# Altium schematic sheet Button.SchDoc
size 420 x 297 mm; Address1: Address1; Address2: Address2; Address3: Address3; Address4: Address4; DocumentNumber: *Э3; SheetNumber: 9; SheetTotal: 14; DocumentType: Схема электрическая *
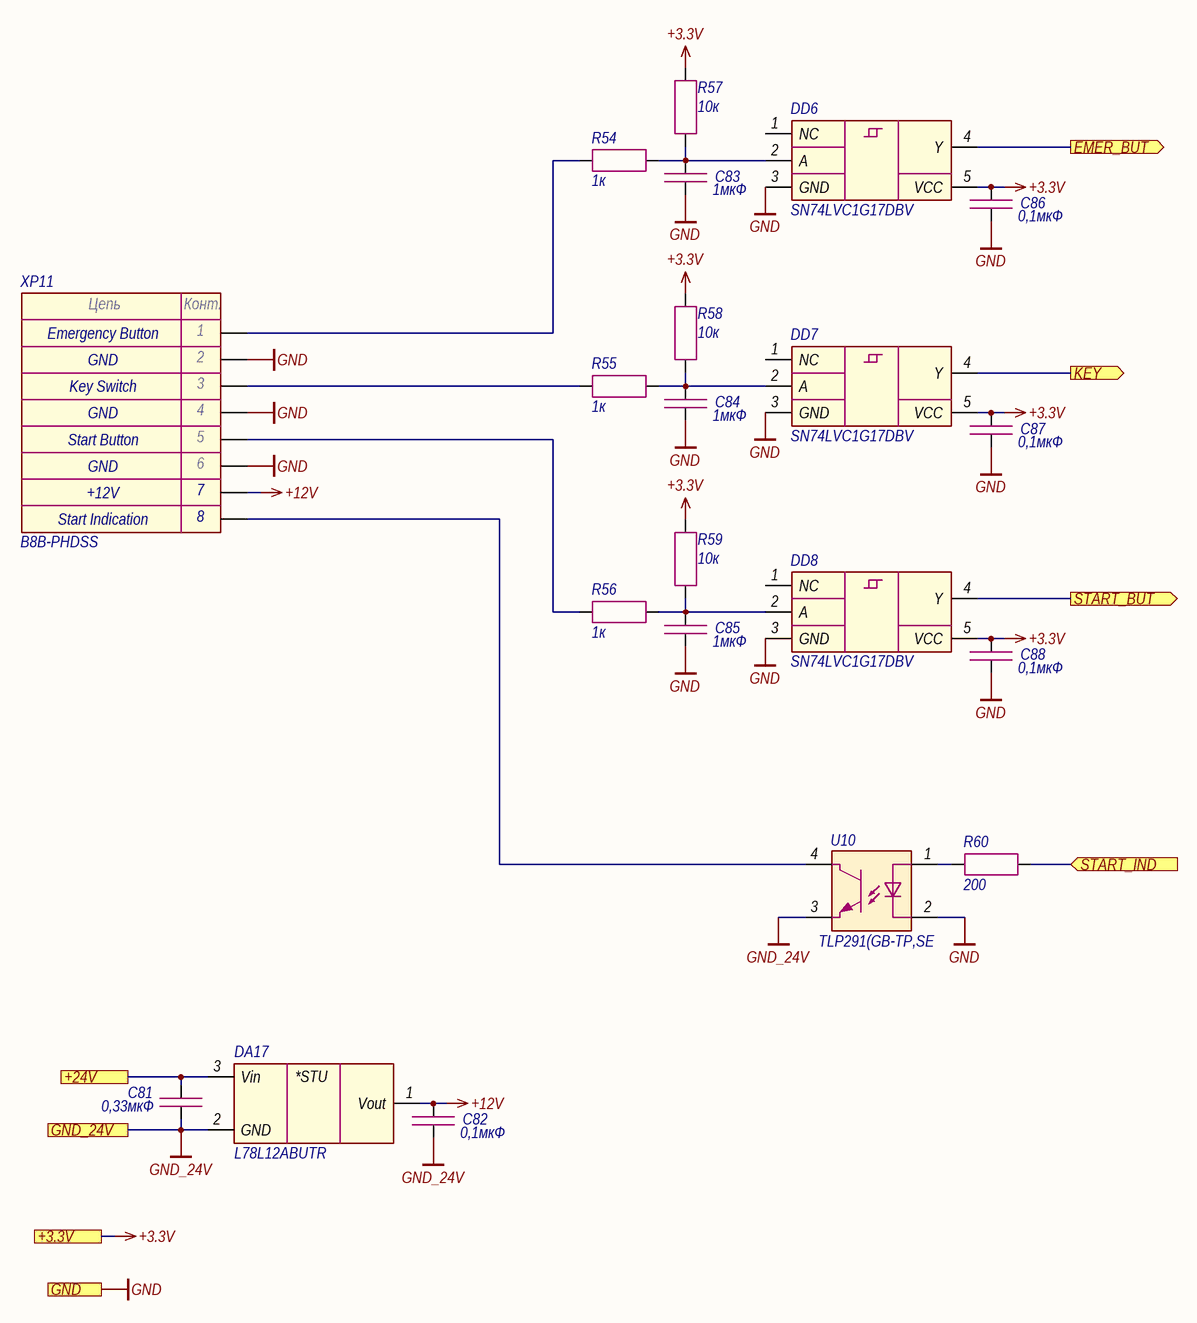
[diagram p0: Button.SchDoc]

## Parts
C81  0,33мкФ  [CAP_0805]
C82  0,1мкФ  [CAP_0603]
C83  1мкФ  [CAP_0603]
C84  1мкФ  [CAP_0603]
C85  1мкФ  [CAP_0603]
C86  0,1мкФ  [CAP_0603]
C87  0,1мкФ  [CAP_0603]
C88  0,1мкФ  [CAP_0603]
DA17  L78L12ABUTR  [SOT-89]
DD6  SN74LVC1G17DBV  [SOT-23-5]
DD7  SN74LVC1G17DBV  [SOT-23-5]
DD8  SN74LVC1G17DBV  [SOT-23-5]
R54  1к  [RES_0603]
R55  1к  [RES_0603]
R56  1к  [RES_0603]
R57  10к  [RES_0603]
R58  10к  [RES_0603]
R59  10к  [RES_0603]
R60  200  [RES_0603]
U10  TLP291(GB-TP,SE  [11-3C1]
XP11  B8B-PHDSS  [B8B-PHDSS]

## Ports
+3.3V (see Main[2C], Ethernet[3D], Fiber_interlock[2C], Flow_sensor[2C], LD_driver[1D], Power_supply[2C], RS-485[2C]), +24V (see Main[2C], Column[1C], Flow_sensor[2C], Indication[1C], LD_driver[1D]), EMER_BUT (out, see Main[2C]), GND (see Main[2C], Column[1C], Ethernet[3D], Fiber_interlock[2C], Flow_sensor[2C], Guide_laser[1C], Indication[1C], LD_driver[1D], Power_supply[2C], RS-485[2C]), GND_24V (see Main[2C], Column[1C], Flow_sensor[2C], Indication[1C], LD_driver[1D]), KEY (out, see Main[2C]), START_BUT (out, see Main[2C]), START_IND (in, see Main[2C])

## Nets
+3.3V: C86.1 C87.1 C88.1 DD6.5(VCC) DD7.5(VCC) DD8.5(VCC) R57.2 R58.2 R59.2 ; port +3.3V
+12V: C82.1 DA17.1(Vout) XP11.7
GND: C83.2 C84.2 C85.2 C86.2 C87.2 C88.2 DD6.3(GND) DD7.3(GND) DD8.3(GND) U10.2 XP11.2 XP11.4 XP11.6 ; port GND
GND_24V: C81.1 C82.2 DA17.2(GND) U10.3 ; port GND_24V
+24V: C81.2 DA17.3(Vin) ; port +24V
EMER_BUT: DD6.4(Y) ; port EMER_BUT
KEY: DD7.4(Y) ; port KEY
START_BUT: DD8.4(Y) ; port START_BUT
START_IND: R60.2 ; port START_IND
NetC83_1: C83.1 DD6.2(A) R54.2 R57.1
NetC84_1: C84.1 DD7.2(A) R55.2 R58.1
NetC85_1: C85.1 DD8.2(A) R56.2 R59.1
NetR54_1: R54.1 XP11.1
NetR55_1: R55.1 XP11.3
NetR56_1: R56.1 XP11.5
NetR60_1: R60.1 U10.1
NetU10_4: U10.4 XP11.8

Not connected (* = marked no-connect by the designer): DD6 1(NC); DD7 1(NC); DD8 1(NC)

## Notes on the sheet
- GND
- (near XP11) Emergency Button
- Start Button
- Key Switch
- +12V
- (near XP11) Start Indication
- Подп. и дата
- Инв. № дубл.
- Взам. инв. №
- Инв. № подл.
- Изм.
- Лист
- № докум.
- Подп.
- Дата
- Копировал
- Формат А3
- (in symbol Connector-8) Цепь; Конт.
- (in symbol LD2981ABU50TR) *STU

## Library data of the parts
C81 = Capacitor: Manufacturer: Murata; Model: GRM219R71H334KA88D; Value: 0,33мкФ; Document: *
C82 C86-C88 = Capacitor: Manufacturer: Murata; Model: GRM188R71H104KA93D; Value: 0,1мкФ; Document: *
C83-C85 = Capacitor: Manufacturer: Murata; Model: GRM188R61H105KAALD; Value: 1мкФ; Document: *
DA17 = LD2981ABU50TR: Manufacturer: STMicroelectronics; Model: L78L12ABUTR; Document: *
DD6-DD8 = SN74LVC1G17: Manufacturer: Texas Instruments; Model: SN74LVC1G17DBV; Document: *
R54-R56 = Resistor: Manufacturer: Yageo; Model: RC0603FR-071KL; Value: 1к; Document: *
R57-R59 = Resistor: Manufacturer: Yageo; Model: RC0603FR-0710KL; Value: 10к; Document: *
R60 = Resistor: Manufacturer: Yageo; Model: RC0603FR-07200RL; Value: 200; Document: *
U10 = TLP291: Manufacturer: Toshiba; Model: TLP291(GB-TP,SE; Document: *
XP11 = Connector-8: Manufacturer: JST; Model: B8B-PHDSS; Document: *